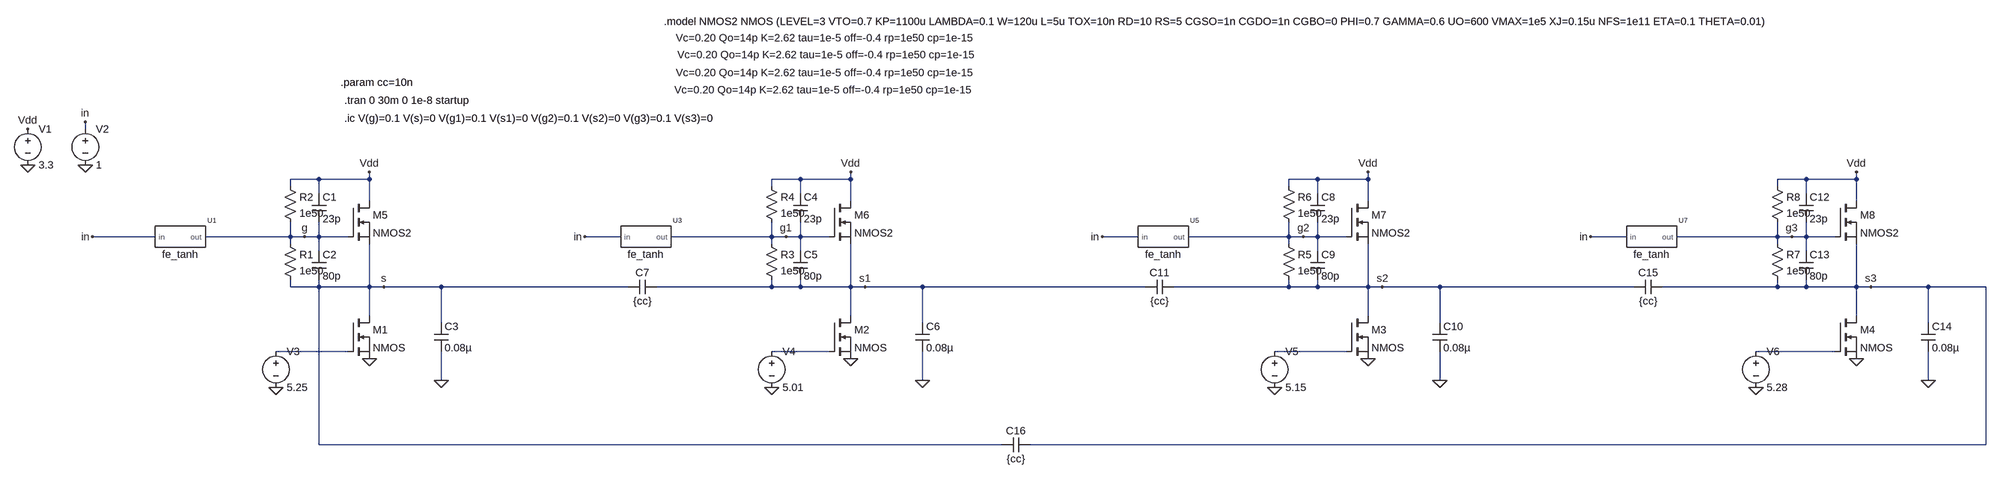
[diagram p0: schematic coupled_oscillators.asc]
coupled_oscillators.asc, the LTspice schematic file:
Version 4
SHEET 1 6256 3524
WIRE -128 -48 -128 -64
WIRE 576 64 512 64
WIRE 688 64 688 48
WIRE 688 64 576 64
WIRE 1648 64 1584 64
WIRE 1760 64 1760 48
WIRE 1760 64 1648 64
WIRE 2800 64 2736 64
WIRE 2912 64 2912 48
WIRE 2912 64 2800 64
WIRE 3888 64 3824 64
WIRE 4000 64 4000 48
WIRE 4000 64 3888 64
WIRE 512 80 512 64
WIRE 1584 80 1584 64
WIRE 2736 80 2736 64
WIRE 3824 80 3824 64
WIRE 576 96 576 64
WIRE 1648 96 1648 64
WIRE 2800 96 2800 64
WIRE 3888 96 3888 64
WIRE 688 112 688 64
WIRE 1760 112 1760 64
WIRE 2912 112 2912 64
WIRE 4000 112 4000 64
WIRE 176 192 -112 192
WIRE 512 192 512 160
WIRE 512 192 288 192
WIRE 544 192 512 192
WIRE 576 192 576 160
WIRE 576 192 544 192
WIRE 640 192 576 192
WIRE 1248 192 1168 192
WIRE 1584 192 1584 160
WIRE 1584 192 1360 192
WIRE 1616 192 1584 192
WIRE 1648 192 1648 160
WIRE 1648 192 1616 192
WIRE 1712 192 1648 192
WIRE 2400 192 2320 192
WIRE 2736 192 2736 160
WIRE 2736 192 2512 192
WIRE 2768 192 2736 192
WIRE 2800 192 2800 160
WIRE 2800 192 2768 192
WIRE 2864 192 2800 192
WIRE 3488 192 3408 192
WIRE 3824 192 3824 160
WIRE 3824 192 3600 192
WIRE 3856 192 3824 192
WIRE 3888 192 3888 160
WIRE 3888 192 3856 192
WIRE 3952 192 3888 192
WIRE 512 208 512 192
WIRE 1584 208 1584 192
WIRE 2736 208 2736 192
WIRE 3824 208 3824 192
WIRE 576 224 576 192
WIRE 1648 224 1648 192
WIRE 2800 224 2800 192
WIRE 3888 224 3888 192
WIRE 512 304 512 288
WIRE 576 304 576 288
WIRE 576 304 512 304
WIRE 688 304 688 208
WIRE 688 304 576 304
WIRE 720 304 688 304
WIRE 848 304 720 304
WIRE 1264 304 848 304
WIRE 1584 304 1584 288
WIRE 1584 304 1328 304
WIRE 1648 304 1648 288
WIRE 1648 304 1584 304
WIRE 1760 304 1760 208
WIRE 1760 304 1648 304
WIRE 1792 304 1760 304
WIRE 1920 304 1792 304
WIRE 2416 304 1920 304
WIRE 2736 304 2736 288
WIRE 2736 304 2480 304
WIRE 2800 304 2800 288
WIRE 2800 304 2736 304
WIRE 2912 304 2912 208
WIRE 2912 304 2800 304
WIRE 2944 304 2912 304
WIRE 3072 304 2944 304
WIRE 3504 304 3072 304
WIRE 3824 304 3824 288
WIRE 3824 304 3568 304
WIRE 3888 304 3888 288
WIRE 3888 304 3824 304
WIRE 4000 304 4000 208
WIRE 4000 304 3888 304
WIRE 4032 304 4000 304
WIRE 4160 304 4032 304
WIRE 4288 304 4160 304
WIRE 688 368 688 304
WIRE 1760 368 1760 304
WIRE 2912 368 2912 304
WIRE 4000 368 4000 304
WIRE 848 384 848 304
WIRE 1920 384 1920 304
WIRE 3072 384 3072 304
WIRE 4160 384 4160 304
WIRE 640 448 480 448
WIRE 1712 448 1584 448
WIRE 2864 448 2704 448
WIRE 3952 448 3776 448
WIRE 848 512 848 448
WIRE 1920 512 1920 448
WIRE 3072 512 3072 448
WIRE 4160 512 4160 448
WIRE 576 656 576 304
WIRE 2096 656 576 656
WIRE 4288 656 4288 304
WIRE 4288 656 2160 656
FLAG -256 32 0
FLAG -256 -48 Vdd
FLAG 688 48 Vdd
FLAG 848 512 0
FLAG -128 32 0
FLAG -112 192 in
FLAG -128 -64 in
FLAG 544 192 g
FLAG 720 304 s
FLAG 1760 48 Vdd
FLAG 1920 512 0
FLAG 1168 192 in
FLAG 1616 192 g1
FLAG 1792 304 s1
FLAG 2912 48 Vdd
FLAG 3072 512 0
FLAG 2320 192 in
FLAG 2768 192 g2
FLAG 2944 304 s2
FLAG 4000 48 Vdd
FLAG 4160 512 0
FLAG 3408 192 in
FLAG 3856 192 g3
FLAG 4032 304 s3
FLAG 4000 464 0
FLAG 2912 464 0
FLAG 1760 464 0
FLAG 688 464 0
FLAG 480 528 0
FLAG 1584 528 0
FLAG 2704 528 0
FLAG 3776 528 0
SYMBOL voltage -256 -64 R0
WINDOW 123 0 0 Left 0
WINDOW 39 0 0 Left 0
SYMATTR InstName V1
SYMATTR Value 3.3
SYMBOL cap 560 96 R0
SYMATTR InstName C1
SYMATTR Value 23p
SYMBOL cap 560 224 R0
SYMATTR InstName C2
SYMATTR Value 80p
SYMBOL res 496 192 R0
SYMATTR InstName R1
SYMATTR Value 1e50
SYMBOL res 496 64 R0
SYMATTR InstName R2
SYMATTR Value 1e50
SYMBOL cap 832 384 R0
SYMATTR InstName C3
SYMATTR Value 0.08µ
SYMBOL voltage -128 -64 R0
WINDOW 123 0 0 Left 0
WINDOW 39 0 0 Left 0
SYMATTR InstName V2
SYMATTR Value 1
SYMBOL fe_tanh 224 192 R0
WINDOW 39 1480 -459 Top 2
SYMATTR SpiceLine Vc=0.20 Qo=14p K=2.62 tau=1e-5 off=-0.4 rp=1e50 cp=1e-15
SYMATTR InstName U1
SYMBOL cap 1632 96 R0
SYMATTR InstName C4
SYMATTR Value 23p
SYMBOL cap 1632 224 R0
SYMATTR InstName C5
SYMATTR Value 80p
SYMBOL res 1568 192 R0
SYMATTR InstName R3
SYMATTR Value 1e50
SYMBOL res 1568 64 R0
SYMATTR InstName R4
SYMATTR Value 1e50
SYMBOL cap 1904 384 R0
SYMATTR InstName C6
SYMATTR Value 0.08µ
SYMBOL fe_tanh 1296 192 R0
WINDOW 39 411 -421 Top 2
SYMATTR SpiceLine Vc=0.20 Qo=14p K=2.62 tau=1e-5 off=-0.4 rp=1e50 cp=1e-15
SYMATTR InstName U3
SYMBOL cap 1328 288 R90
WINDOW 0 0 32 VBottom 2
WINDOW 3 32 32 VTop 2
SYMATTR InstName C7
SYMATTR Value {cc}
SYMBOL cap 2784 96 R0
SYMATTR InstName C8
SYMATTR Value 23p
SYMBOL cap 2784 224 R0
SYMATTR InstName C9
SYMATTR Value 80p
SYMBOL res 2720 192 R0
SYMATTR InstName R5
SYMATTR Value 1e50
SYMBOL res 2720 64 R0
SYMATTR InstName R6
SYMATTR Value 1e50
SYMBOL cap 3056 384 R0
SYMATTR InstName C10
SYMATTR Value 0.08µ
SYMBOL fe_tanh 2448 192 R0
WINDOW 39 -744 -381 Top 2
SYMATTR SpiceLine Vc=0.20 Qo=14p K=2.62 tau=1e-5 off=-0.4 rp=1e50 cp=1e-15
SYMATTR InstName U5
SYMBOL cap 2480 288 R90
WINDOW 0 0 32 VBottom 2
WINDOW 3 32 32 VTop 2
SYMATTR InstName C11
SYMATTR Value {cc}
SYMBOL cap 3872 96 R0
SYMATTR InstName C12
SYMATTR Value 23p
SYMBOL cap 3872 224 R0
SYMATTR InstName C13
SYMATTR Value 80p
SYMBOL res 3808 192 R0
SYMATTR InstName R7
SYMATTR Value 1e50
SYMBOL res 3808 64 R0
SYMATTR InstName R8
SYMATTR Value 1e50
SYMBOL cap 4144 384 R0
SYMATTR InstName C14
SYMATTR Value 0.08µ
SYMBOL fe_tanh 3536 192 R0
WINDOW 39 -1836 -343 Top 2
SYMATTR SpiceLine Vc=0.20 Qo=14p K=2.62 tau=1e-5 off=-0.4 rp=1e50 cp=1e-15
SYMATTR InstName U7
SYMBOL cap 3568 288 R90
WINDOW 0 0 32 VBottom 2
WINDOW 3 32 32 VTop 2
SYMATTR InstName C15
SYMATTR Value {cc}
SYMBOL cap 2160 640 R90
WINDOW 0 0 32 VBottom 2
WINDOW 3 32 32 VTop 2
SYMATTR InstName C16
SYMATTR Value {cc}
SYMBOL nmos 640 112 R0
SYMATTR InstName M5
SYMATTR Value NMOS2
SYMBOL nmos 1712 112 R0
SYMATTR InstName M6
SYMATTR Value NMOS2
SYMBOL nmos 2864 112 R0
SYMATTR InstName M7
SYMATTR Value NMOS2
SYMBOL nmos 3952 112 R0
SYMATTR InstName M8
SYMATTR Value NMOS2
SYMBOL nmos 640 368 R0
SYMATTR InstName M1
SYMBOL nmos 1712 368 R0
SYMATTR InstName M2
SYMBOL nmos 2864 368 R0
SYMATTR InstName M3
SYMBOL nmos 3952 368 R0
SYMATTR InstName M4
SYMBOL voltage 480 432 R0
WINDOW 123 0 0 Left 0
WINDOW 39 0 0 Left 0
SYMATTR InstName V3
SYMATTR Value 5.25
SYMBOL voltage 1584 432 R0
WINDOW 123 0 0 Left 0
WINDOW 39 0 0 Left 0
SYMATTR InstName V4
SYMATTR Value 5.01
SYMBOL voltage 2704 432 R0
WINDOW 123 0 0 Left 0
WINDOW 39 0 0 Left 0
SYMATTR InstName V5
SYMATTR Value 5.15
SYMBOL voltage 3776 432 R0
WINDOW 123 0 0 Left 0
WINDOW 39 0 0 Left 0
SYMATTR InstName V6
SYMATTR Value 5.28
TEXT 632 -72 Left 2 !.ic V(g)=0.1 V(s)=0 V(g1)=0.1 V(s1)=0 V(g2)=0.1 V(s2)=0 V(g3)=0.1 V(s3)=0
TEXT 632 -112 Left 2 !.tran 0 30m 0 1e-8 startup
TEXT 624 -152 Left 2 !.param cc=10n
TEXT 1344 -288 Left 2 !.model NMOS2 NMOS (LEVEL=3 VTO=0.7 KP=1100u LAMBDA=0.1 W=120u L=5u TOX=10n RD=10 RS=5 CGSO=1n CGDO=1n CGBO=0 PHI=0.7 GAMMA=0.6 UO=600 VMAX=1e5 XJ=0.15u NFS=1e11 ETA=0.1 THETA=0.01)

The netlist it stands for:
* coupled_oscillators.asc
V1 Vdd 0 3.3
C1 Vdd g 23p
C2 g s 80p
R1 g s 1e50
R2 Vdd g 1e50
C3 s 0 0.08µ
V2 in 0 1
XU1 in g fe_tanh Vc=0.20 Qo=14p K=2.62 tau=1e-5 off=-0.4 rp=1e50 cp=1e-15  ; pins in out
C4 Vdd g1 23p
C5 g1 s1 80p
R3 g1 s1 1e50
R4 Vdd g1 1e50
C6 s1 0 0.08µ
XU3 in g1 fe_tanh Vc=0.20 Qo=14p K=2.62 tau=1e-5 off=-0.4 rp=1e50 cp=1e-15  ; pins in out
C7 s1 s {cc}
C8 Vdd g2 23p
C9 g2 s2 80p
R5 g2 s2 1e50
R6 Vdd g2 1e50
C10 s2 0 0.08µ
XU5 in g2 fe_tanh Vc=0.20 Qo=14p K=2.62 tau=1e-5 off=-0.4 rp=1e50 cp=1e-15  ; pins in out
C11 s2 s1 {cc}
C12 Vdd g3 23p
C13 g3 s3 80p
R7 g3 s3 1e50
R8 Vdd g3 1e50
C14 s3 0 0.08µ
XU7 in g3 fe_tanh Vc=0.20 Qo=14p K=2.62 tau=1e-5 off=-0.4 rp=1e50 cp=1e-15  ; pins in out
C15 s3 s2 {cc}
C16 s3 s {cc}
M5 Vdd g s s NMOS2
M6 Vdd g1 s1 s1 NMOS2
M7 Vdd g2 s2 s2 NMOS2
M8 Vdd g3 s3 s3 NMOS2
M1 s N001 0 0 NMOS
M2 s1 N002 0 0 NMOS
M3 s2 N003 0 0 NMOS
M4 s3 N004 0 0 NMOS
V3 N001 0 5.25
V4 N002 0 5.01
V5 N003 0 5.15
V6 N004 0 5.28
.model NMOS NMOS
.model PMOS PMOS
.lib standard.mos
.ic V(g)=0.1 V(s)=0 V(g1)=0.1 V(s1)=0 V(g2)=0.1 V(s2)=0 V(g3)=0.1 V(s3)=0
.tran 0 30m 0 1e-8 startup
.param cc=10n
.model NMOS2 NMOS (LEVEL=3 VTO=0.7 KP=1100u LAMBDA=0.1 W=120u L=5u TOX=10n RD=10 RS=5 CGSO=1n CGDO=1n CGBO=0 PHI=0.7 GAMMA=0.6 UO=600 VMAX=1e5 XJ=0.15u NFS=1e11 ETA=0.1 THETA=0.01)
.lib C:\Users\MBX\Desktop\Investigacion\Spice-LK-Model\Fe_model\fe_tanh_ni.sp
.backanno
.end